# Altium schematic sheet Main Board - Copy.SchDoc
size A3
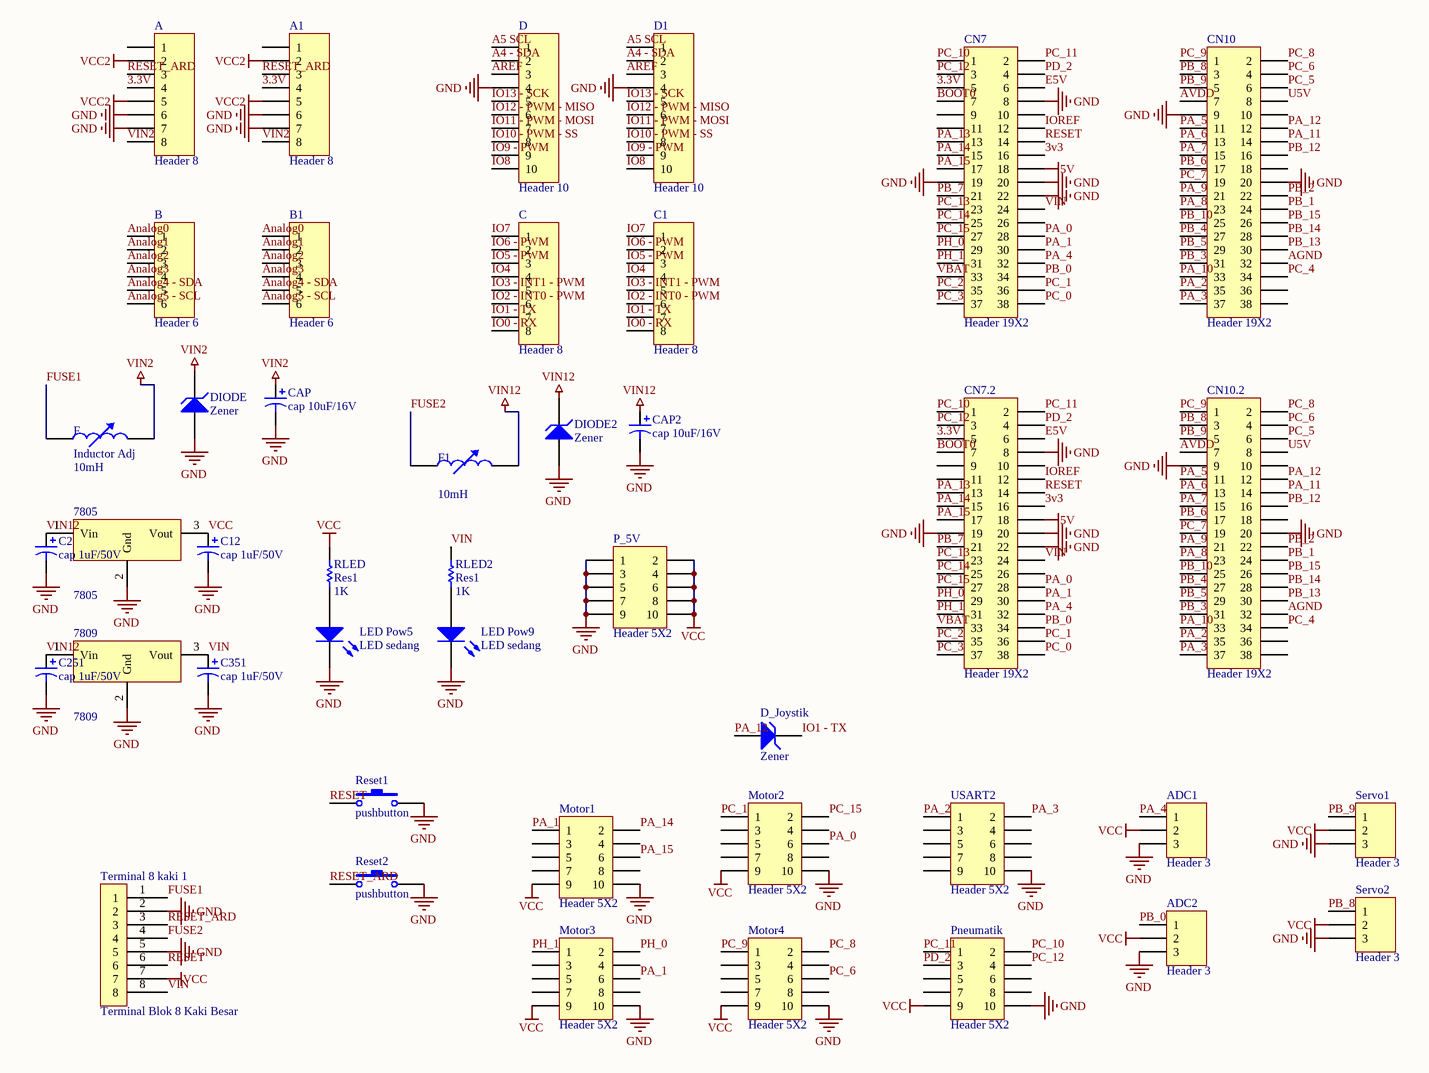
[diagram p0: Main Board - Copy.SchDoc]

## Parts
7805  7805  [78XX/79XX]
7809  7809  [78XX/79XX]
A  Header 8  [HDR1X8]
A1  Header 8  [HDR1X8]
ADC1  Header 3  [HDR1X3]
ADC2  Header 3  [HDR1X3]
B  Header 6  [HDR1X6]
B1  Header 6  [HDR1X6]
C  Header 8  [HDR1X8]
C1  Header 8  [HDR1X8]
C2  cap 1uF/50V  [cap 1uF/50V]
C12  cap 1uF/50V  [cap 1uF/50V]
C251  cap 1uF/50V  [cap 1uF/50V]
C351  cap 1uF/50V  [cap 1uF/50V]
CAP  cap 10uF/16V  [cap 10uF/16V]
CAP2  cap 10uF/16V  [cap 10uF/16V]
CN7  Header 19X2  [HDR2X19]
CN7.2  Header 19X2  [HDR2X19]
CN10  Header 19X2  [HDR2X19]
CN10.2  Header 19X2  [HDR2X19]
D  Header 10  [HDR1X10]
D1  Header 10  [HDR1X10]
D_Joystik  Zener  [D Zener]
DIODE  Zener  [D Zener]
DIODE2  Zener  [D Zener]
F  Inductor Adj  value 10mH  [AXIAL-0.8]
F1  value 10mH  [AXIAL-0.8]  (hidden comment: Inductor Adj)
LED_Pow5  LED sedang  [LED sedang]
LED_Pow9  LED sedang  [LED sedang]
Motor1  Header 5X2  [HDR2X5]
Motor2  Header 5X2  [HDR2X5]
Motor3  Header 5X2  [HDR2X5]
Motor4  Header 5X2  [HDR2X5]
P_5V  Header 5X2  [HDR2X5]
Pneumatik  Header 5X2  [HDR2X5]
Reset1  pushbutton  [pushbutton]
Reset2  pushbutton  [pushbutton]
RLED  Res1  value 1K  [AXIAL-0.3]
RLED2  Res1  value 1K  [AXIAL-0.3]
Servo1  Header 3  [HDR1X3]
Servo2  Header 3  [HDR1X3]
Terminal_8_kaki_1  Terminal Blok 8 Kaki Besar  [TERMINAL 8 KAKI]
USART2  Header 5X2  [HDR2X5]

## Nets
5V: CN7.18 CN7.2.18
GND: 7805.2(Gnd) 7809.2(Gnd) A.6 A.7 A1.6 A1.7 ADC1.3 ADC2.3 C2.2 C12.2 C251.2 C351.2 CAP.2 CAP2.2 CN7.8 CN7.19 CN7.20 CN7.22 CN7.2.8 CN7.2.19 CN7.2.20 CN7.2.22 CN10.9 CN10.20 CN10.2.9 CN10.2.20 D.4 D1.4 DIODE.1(A) DIODE2.1(A) LED_Pow5.2(K) LED_Pow9.2(K) Motor1.10 Motor2.10 Motor3.10 Motor4.10 P_5V.1 P_5V.3 P_5V.5 P_5V.7 P_5V.9 Pneumatik.10 Reset1.2 Reset2.2 Servo1.3 Servo2.3 Terminal_8_kaki_1.2 Terminal_8_kaki_1.5 USART2.10
VCC: 7805.3(Vout) ADC1.2 ADC2.2 C12.1 Motor1.9 Motor2.9 Motor3.9 Motor4.9 P_5V.2 P_5V.4 P_5V.6 P_5V.8 P_5V.10 Pneumatik.9 RLED.2 Servo1.2 Servo2.2 Terminal_8_kaki_1.7
VCC2: A.2 A.5 A1.2 A1.5
VIN2: A.8 A1.8 CAP.1 DIODE.2(K) F.2
VIN12: 7805.1(Vin) 7809.1(Vin) C2.1 C251.1 CAP2.1 DIODE2.2(K) F1.2
3.3V: A.4 A1.4 CN7.5 CN7.2.5
3v3: CN7.16 CN7.2.16
A4 - SDA: D.2 D1.2
A5 SCL: D.1 D1.1
AGND: CN10.32 CN10.2.32
Analog0: B.1 B1.1
Analog1: B.2 B1.2
Analog2: B.3 B1.3
Analog3: B.4 B1.4
Analog4 - SDA: B.5 B1.5
Analog5 - SCL: B.6 B1.6
AREF: D.3 D1.3
AVDD: CN10.7 CN10.2.7
BOOT0: CN7.7 CN7.2.7
E5V: CN7.6 CN7.2.6
FUSE1: F.1 Terminal_8_kaki_1.1
FUSE2: F1.1 Terminal_8_kaki_1.4
IO0 - RX: C.8 C1.8
IO1 - TX: C.7 C1.7 D_Joystik.2(K)
IO2 - INT0 - PWM: C.6 C1.6
IO3 - INT1 - PWM: C.5 C1.5
IO4: C.4 C1.4
IO5 - PWM: C.3 C1.3
IO6 - PWM: C.2 C1.2
IO7: C.1 C1.1
IO8: D.10 D1.10
IO9 - PWM: D.9 D1.9
IO10 - PWM - SS: D.8 D1.8
IO11 - PWM - MOSI: D.7 D1.7
IO12 - PWM - MISO: D.6 D1.6
IO13 - SCK: D.5 D1.5
IOREF: CN7.12 CN7.2.12
PA_0: CN7.28 CN7.2.28 Motor2.6
PA_1: CN7.30 CN7.2.30 Motor3.6
PA_2: CN10.35 CN10.2.35 USART2.1
PA_3: CN10.37 CN10.2.37 USART2.2
PA_4: ADC1.1 CN7.32 CN7.2.32
PA_5: CN10.11 CN10.2.11
PA_6: CN10.13 CN10.2.13
PA_7: CN10.15 CN10.2.15
PA_8: CN10.23 CN10.2.23
PA_9: CN10.21 CN10.2.21
PA_10: CN10.33 CN10.2.33
PA_11: CN10.14 CN10.2.14
PA_12: CN10.12 CN10.2.12 D_Joystik.1(A)
PA_13: CN7.13 CN7.2.13 Motor1.1
PA_14: CN7.15 CN7.2.15 Motor1.2
PA_15: CN7.17 CN7.2.17 Motor1.6
PB_0: ADC2.1 CN7.34 CN7.2.34
PB_1: CN10.24 CN10.2.24
PB_2: CN10.22 CN10.2.22
PB_3: CN10.31 CN10.2.31
PB_4: CN10.27 CN10.2.27
PB_5: CN10.29 CN10.2.29
PB_6: CN10.17 CN10.2.17
PB_7: CN7.21 CN7.2.21
PB_8: CN10.3 CN10.2.3 Servo2.1
PB_9: CN10.5 CN10.2.5 Servo1.1
PB_10: CN10.25 CN10.2.25
PB_12: CN10.16 CN10.2.16
PB_13: CN10.30 CN10.2.30
PB_14: CN10.28 CN10.2.28
PB_15: CN10.26 CN10.2.26
PC_0: CN7.38 CN7.2.38
PC_1: CN7.36 CN7.2.36
PC_2: CN7.35 CN7.2.35
PC_3: CN7.37 CN7.2.37
PC_4: CN10.34 CN10.2.34
PC_5: CN10.6 CN10.2.6
PC_6: CN10.4 CN10.2.4 Motor4.6
PC_7: CN10.19 CN10.2.19
PC_8: CN10.2 CN10.2.2 Motor4.2
PC_9: CN10.1 CN10.2.1 Motor4.1
PC_10: CN7.1 CN7.2.1 Pneumatik.2
PC_11: CN7.2 CN7.2.2 Pneumatik.1
PC_12: CN7.3 CN7.2.3 Pneumatik.4
PC_13: CN7.23 CN7.2.23
PC_14: CN7.25 CN7.2.25 Motor2.1
PC_15: CN7.27 CN7.2.27 Motor2.2
PD_2: CN7.4 CN7.2.4 Pneumatik.3
PH_0: CN7.29 CN7.2.29 Motor3.2
PH_1: CN7.31 CN7.2.31 Motor3.1
RESET: CN7.14 CN7.2.14 Reset1.1 Terminal_8_kaki_1.6
RESET_ARD: A.3 A1.3 Reset2.1 Terminal_8_kaki_1.3
U5V: CN10.8 CN10.2.8
VBAT: CN7.33 CN7.2.33
VIN: 7809.3(Vout) C351.1 CN7.24 CN7.2.24 RLED2.2 Terminal_8_kaki_1.8
NetLED_Pow5_1: LED_Pow5.1(A) RLED.1
NetLED_Pow9_1: LED_Pow9.1(A) RLED2.1

Not connected (* = marked no-connect by the designer): A 1; A1 1; CN7 9 10 11 26; CN7.2 9 10 11 26; CN10 10 18 36 38; CN10.2 10 18 36 38; Motor1 3 4 5 7 8; Motor2 3 4 5 7 8; Motor3 3 4 5 7 8; Motor4 3 4 5 7 8; Pneumatik 5 6 7 8; USART2 3 4 5 6 7 8 9

## Library data of the parts
7805 7809 = 7805/7809/7812/7905/7909/7912
A A1 C C1 = Header 8: Header, 8-Pin; LatestRevisionDate: 17-Jul-2002; LatestRevisionNote: Re-released for DXP Platform.; Publisher: Altium Limited
ADC1 ADC2 Servo1 Servo2 = Header 3: Header, 3-Pin; LatestRevisionDate: 17-Jul-2002; LatestRevisionNote: Re-released for DXP Platform.; Publisher: Altium Limited
B B1 = Header 6: Header, 6-Pin; LatestRevisionDate: 17-Jul-2002; LatestRevisionNote: Re-released for DXP Platform.; Publisher: Altium Limited
CN7 CN7.2 CN10 CN10.2 = Header 19X2: Header, 19-Pin, Dual row; LatestRevisionDate: 17-Jul-2002; LatestRevisionNote: Re-released for DXP Platform.; Publisher: Altium Limited
D D1 = Header 10: Header, 10-Pin; LatestRevisionDate: 17-Jul-2002; LatestRevisionNote: Re-released for DXP Platform.; Publisher: Altium Limited
D_Joystik DIODE DIODE2 = D Zener
F F1 = Inductor Adj: Adjustable Inductor; Set Position: 0.5; Published: 24-Mar-1999; LatestRevisionDate: 17-Jul-2002; LatestRevisionNote: Re-released for DXP Platform.; PackageReference: AXIAL-0.8; Publisher: Altium Limited
Motor1-Motor4 P_5V Pneumatik USART2 = Header 5X2: Header, 5-Pin, Dual row; LatestRevisionDate: 17-Jul-2002; LatestRevisionNote: Re-released for DXP Platform.; Publisher: Altium Limited
RLED RLED2 = Res1: Resistor; Published: 8-Jun-2000; LatestRevisionDate: 17-Jul-2002; LatestRevisionNote: Re-released for DXP Platform.; PackageReference: AXIAL-0.3; Publisher: Altium Limited
Terminal_8_kaki_1 = Terminal Block 8 kaki